# EAGLE design psu (EAGLE 6.4)

## Sheet 1 of 2
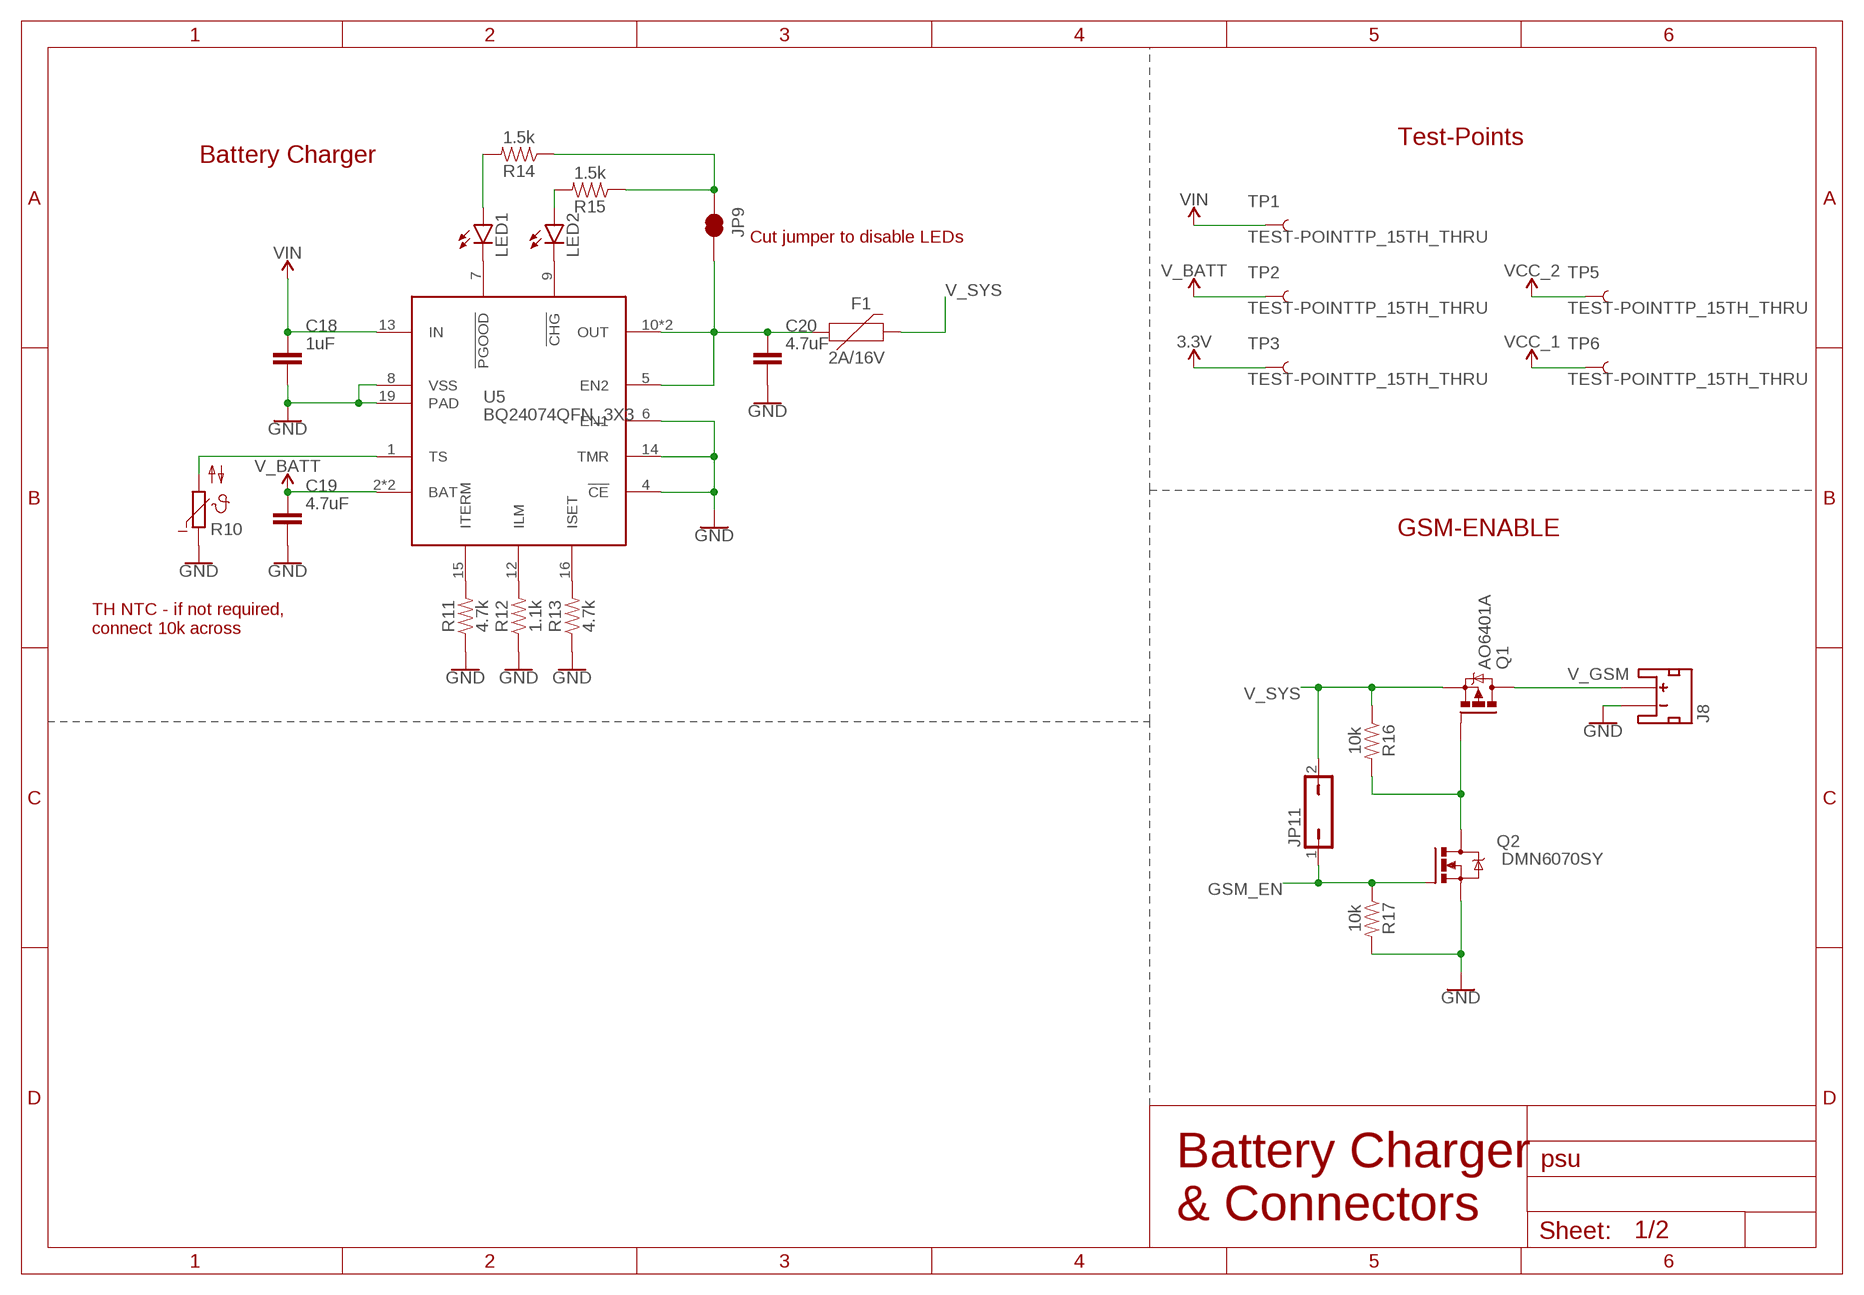
[diagram p0: schematic, sheet 1]

### Parts
C18  1uF  C_CHIP-0805(2012-METRIC)  [CAPC2012X110]
C19  4.7uF  C_CHIP-0805(2012-METRIC)  [CAPC2012X110]
C20  4.7uF  C_CHIP-0805(2012-METRIC)  [CAPC2012X110]
F1  2A/16V  PPTC_2A  [F1812]
J8  JST_2MM_MALE  [JST-2-SMD]
JP9  JUMPER-SMT_2_NC_TRACE_SILK  [SMT-JUMPER_2_NC_TRACE_SILK]
JP11  JP1Q  [JP1]
LED1  LEDSML0805  [SML0805]
LED2  LEDSML0805  [SML0805]
Q1  AO6401A  [TSOP-6]
Q2  DMN6070SY  DMN6070SY-13  [SOT-89-3]
R10  DNF  NTC640  [P640]
R11  4.7k  RESISTOR0603  [0603]
R12  1.1k  RESISTOR0603  [0603]
R13  4.7k  RESISTOR0603  [0603]
R14  1.5k  RESISTOR0603  [0603]
R15  1.5k  RESISTOR0603  [0603]
R16  10k  RESISTOR0603  [0603]
R17  10k  RESISTOR0603  [0603]
TP1  TEST-POINTTP_15TH_THRU  [TP_15TH]
TP2  TEST-POINTTP_15TH_THRU  [TP_15TH]
TP3  TEST-POINTTP_15TH_THRU  [TP_15TH]
TP5  TEST-POINTTP_15TH_THRU  [TP_15TH]
TP6  TEST-POINTTP_15TH_THRU  [TP_15TH]
U5  BQ24074QFN_3X3  [QFN_3X3]

### Nets
3.3V: TP3.P$1 ; also sheet 2
GND: C18.2 C19.2 C20.2 J8.1(-) Q2.3(S) R10.1 R11.1 R12.1 R13.1 R17.2 U5.4(!CE) U5.6(EN1) U5.8(VSS) U5.14(TMR) U5.19(PAD) ; also sheet 2
GSM_EN: JP11.1 Q2.1(G) R17.1
N$19: R10.2 U5.1(TS)
N$20: R11.2 U5.15(ITERM)
N$21: R12.2 U5.12(ILM)
N$22: R13.2 U5.16(ISET)
N$23: LED1.C U5.7(!PGOOD)
N$24: LED2.C U5.9(!CHG)
N$25: JP9.1 R14.1 R15.1
N$27: LED1.A R14.2
N$28: LED2.A R15.2
N$29: C20.1 F1.1 JP9.2 U5.5(EN2) U5.10(OUT) U5.11(OUT)
N$34: Q1.3(G) Q2.2(D) Q2.4(D) R16.2
V_BATT: C19.1 TP2.P$1 U5.2(BAT) U5.3(BAT)
V_GSM: J8.2(+) Q1.1(D) Q1.2(D) Q1.5(D) Q1.6(D)
V_SYS: F1.2 JP11.2 Q1.4(S) R16.1 ; also sheet 2
VCC_1: TP6.P$1 ; also sheet 2
VCC_2: TP5.P$1 ; also sheet 2
VIN: C18.1 TP1.P$1 U5.13(IN)
Unconnected: J8.NC1(PAD1) J8.NC2(PAD2)

### Notes on the sheet
- Test-Points
- Battery Charger
- Cut jumper to disable LEDs
- GSM-ENABLE
- TH NTC - if not required, 
  connect 10k across
- Battery Charger 
  & Connectors

## Sheet 2 of 2
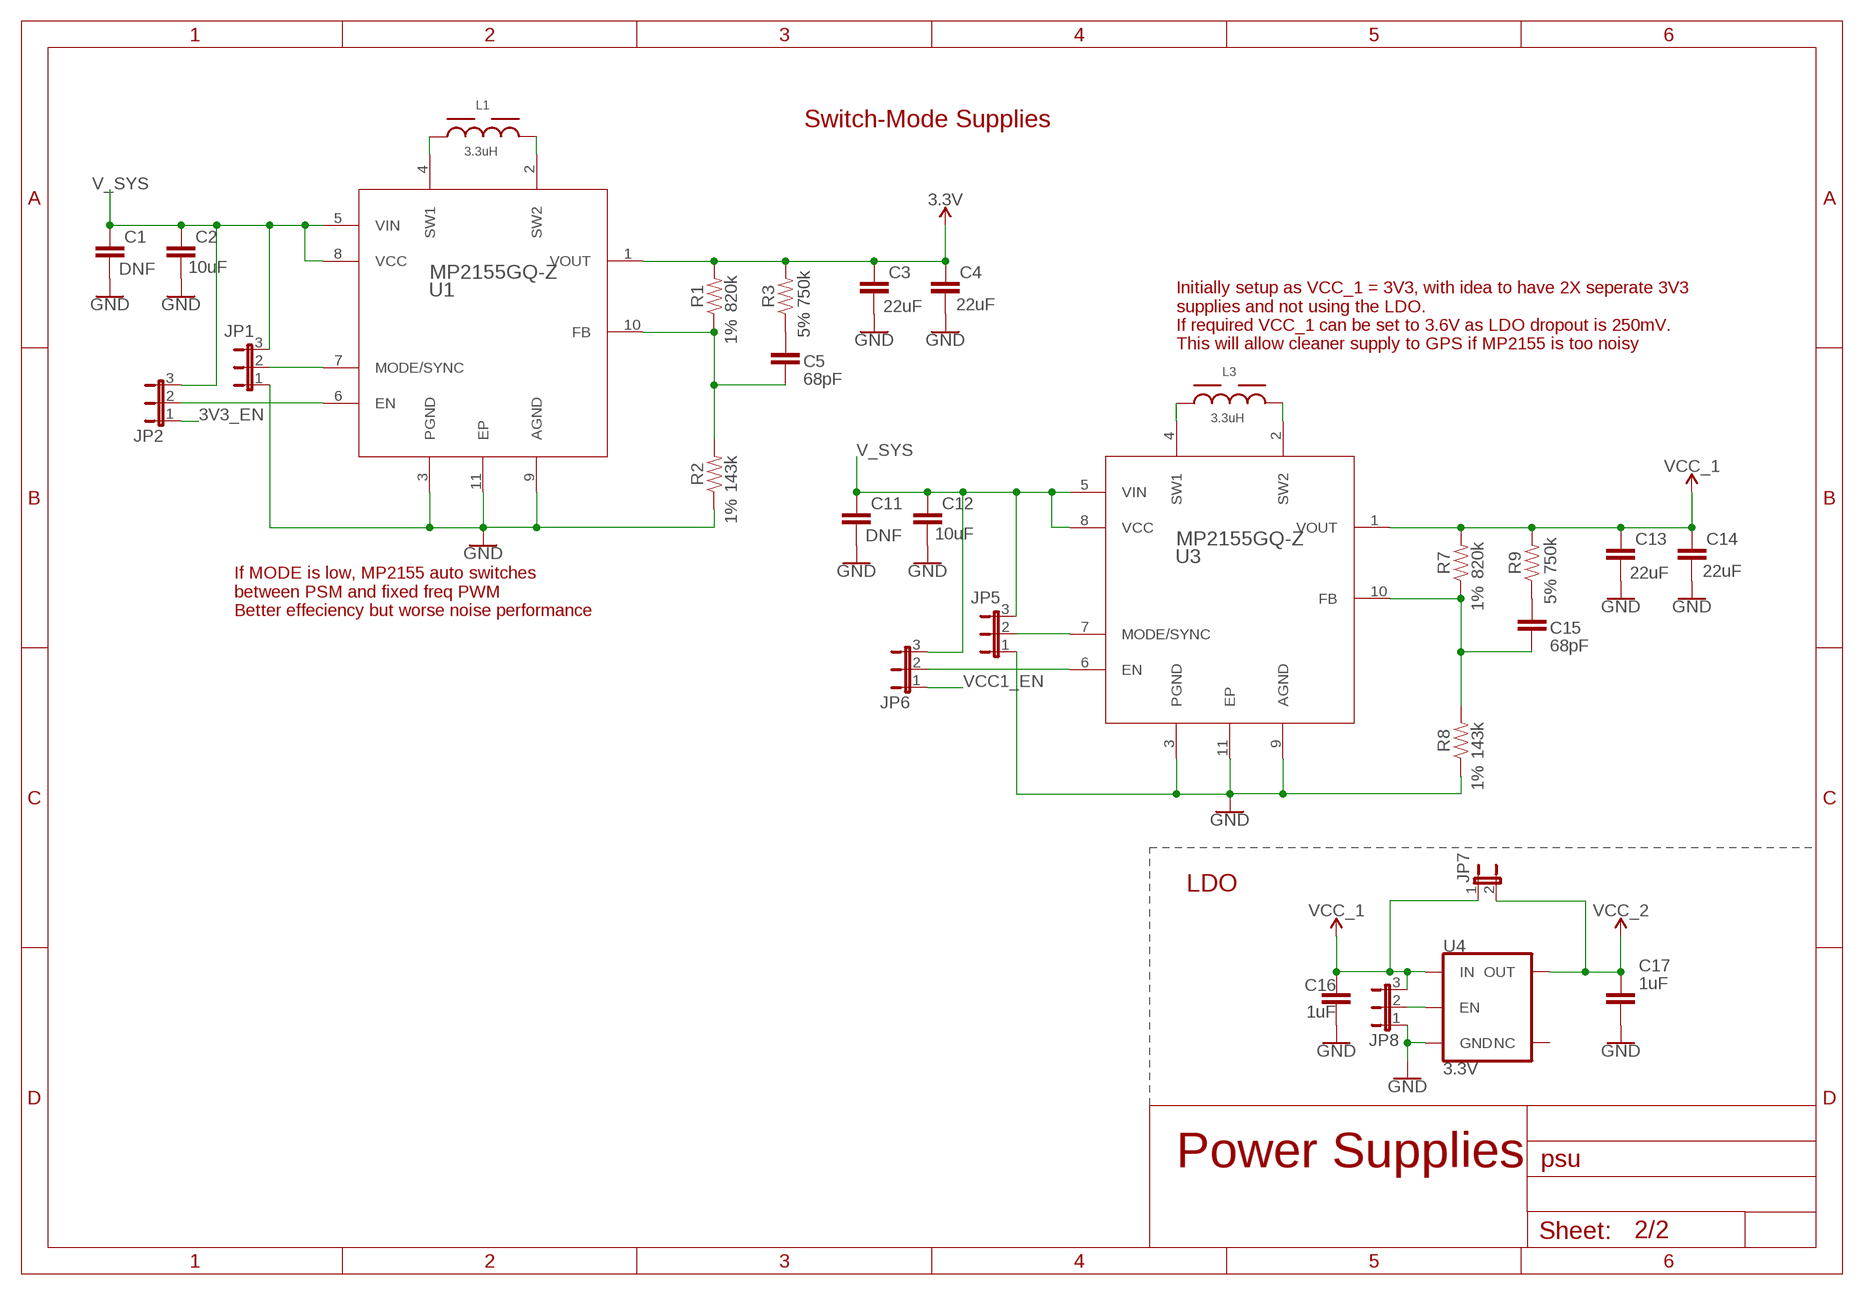
[diagram p1: schematic, sheet 2]

### Parts
C1  DNF  C_CHIP-0805(2012-METRIC)  [CAPC2012X110]
C2  10uF  C_CHIP-0805(2012-METRIC)  [CAPC2012X110]
C3  22uF  C_CHIP-0805(2012-METRIC)  [CAPC2012X110]
C4  22uF  C_CHIP-0805(2012-METRIC)  [CAPC2012X110]
C5  68pF  C_CHIP-0603(1608-METRIC)  [CAPC1608X85]
C11  DNF  C_CHIP-0805(2012-METRIC)  [CAPC2012X110]
C12  10uF  C_CHIP-0805(2012-METRIC)  [CAPC2012X110]
C13  22uF  C_CHIP-0805(2012-METRIC)  [CAPC2012X110]
C14  22uF  C_CHIP-0805(2012-METRIC)  [CAPC2012X110]
C15  68pF  C_CHIP-0603(1608-METRIC)  [CAPC1608X85]
C16  1uF  C_CHIP-0805(2012-METRIC)  [CAPC2012X110]
C17  1uF  C_CHIP-0805(2012-METRIC)  [CAPC2012X110]
JP1  JP2E  [JP2]
JP2  JP2E  [JP2]
JP5  JP2E  [JP2]
JP6  JP2E  [JP2]
JP7  JP1E  [JP1]
JP8  JP2E  [JP2]
L1  3.3uH  WE-HCI_7050_744314330  [WE-HCI_7050]
L3  3.3uH  WE-HCI_7050_744314330  [WE-HCI_7050]
R1  820k  RESISTOR0603  [0603]
R2  143k  RESISTOR0603  [0603]
R3  750k  RESISTOR0603  [0603]
R7  820k  RESISTOR0603  [0603]
R8  143k  RESISTOR0603  [0603]
R9  750k  RESISTOR0603  [0603]
U1  MP2155GQ-Z  [QFN-10_MP2155_MNP]
U3  MP2155GQ-Z  [QFN-10_MP2155_MNP]
U4  3.3V  V_REG_AP2112K-3.3V  [SOT23-5]

### Nets
3.3V: C3.1 C4.1 R1.2 R3.2 U1.1(VOUT) ; also sheet 1
3V3_EN: JP2.1
GND: C1.2 C2.2 C3.2 C4.2 C11.2 C12.2 C13.2 C14.2 C16.2 C17.2 JP1.1 JP5.1 JP8.1 R2.1 R8.1 U1.3(PGND) U1.9(AGND) U1.11(EP) U3.3(PGND) U3.9(AGND) U3.11(EP) U4.2(GND) ; also sheet 1
N$1: C5.1 R3.1
N$2: JP1.2 U1.7(MODE/SYNC)
N$3: C5.2 R1.1 R2.2 U1.10(FB)
N$4: JP2.2 U1.6(EN)
N$5: L1.1 U1.4(SW1)
N$6: L1.2 U1.2(SW2)
N$13: JP5.2 U3.7(MODE/SYNC)
N$14: JP6.2 U3.6(EN)
N$15: C15.2 R7.1 R8.2 U3.10(FB)
N$16: C15.1 R9.1
N$17: L3.1 U3.4(SW1)
N$18: L3.2 U3.2(SW2)
N$26: JP8.2 U4.3(EN)
V_SYS: C1.1 C2.1 C11.1 C12.1 JP1.3 JP2.3 JP5.3 JP6.3 U1.5(VIN) U1.8(VCC) U3.5(VIN) U3.8(VCC) ; also sheet 1
VCC1_EN: JP6.1
VCC_1: C13.1 C14.1 C16.1 JP7.1 JP8.3 R7.2 R9.2 U3.1(VOUT) U4.1(IN) ; also sheet 1
VCC_2: C17.1 JP7.2 U4.5(OUT) ; also sheet 1
Unconnected: U4.4(NC)

### Notes on the sheet
- Switch-Mode Supplies
- Initially setup as VCC_1 = 3V3, with idea to have 2X seperate 3V3 
  supplies and not using the LDO.
  If required VCC_1 can be set to 3.6V as LDO dropout is 250mV.
  This will allow cleaner supply to GPS if MP2155 is too noisy
- If MODE is low, MP2155 auto switches 
  between PSM and fixed freq PWM
  Better effeciency but worse noise performance
- LDO
- Power Supplies

## Library data of the parts
C1 C11 C16-C20 = Capacitor:C: Capacitor - Generic; CATEGORY: Capacitor
C2 C12 = Capacitor:C: Capacitor - Generic; CATEGORY: Capacitor; TYPE: X7R; VOLTAGE_RATING: 6.3V
C3 C4 C13 C14 = Capacitor:C: Capacitor - Generic; CATEGORY: Capacitor; TYPE: X5R; VOLTAGE_RATING: 10V
C5 C15 = Capacitor:C: Capacitor - Generic; CATEGORY: Capacitor; TYPE: X7R; VOLTAGE_RATING: 50V
F1 = GlacTracker:PPTC_2A
J8 = SparkFun-Connectors:JST_2MM_MALE: JST 2MM MALE RA CONNECTOR Two pin, compact surface mount connector. Commonly used as a battery input connection point. We really like the solid locking feeling and high current rating on these small connectors. We use these all the time as battery connectors. Mates to single-cell LiPo batteries. Here is the connector we sell at SparkFun: JST Right Angle Connector - White <https://www.sparkfun.com/products/8612> (PRT-08612) Datasheet <http://www.sparkfun.com/datasheets/Prototyping/Connectors/JST-Horizontal.pdf> It was used on these SparkFun products: SparkFun MOSFET Power Controller <https://www.sparkfun.com/products/11214> (PRT-11214) SparkFun Battery Babysitter - LiPo Battery Manager <https://www.sparkfun.com/products/13777> (PRT-13777) And many, many others that required a lipo battery connection.; PROD_ID: CONN-11443; SF_ID: PRT-08612
JP1 JP2 JP5 JP6 JP8 = jumper:JP2E: JUMPER
JP7 = jumper:JP1E: JUMPER
JP9 = SparkFun-Jumpers:JUMPER-SMT_2_NC_TRACE: Normally closed trace jumper This jumper has a trace between two pads so it's normally closed (NC). Use a razor knife to open the connection. For best results follow the IPC guidelines for cutting traces: Cutout at least 0.063 mm (0.005 in). Remove all loose material to clean up the cut area. Seal the cut with an approved epoxy. Reapply solder to reclose the connection.
JP11 = jumper:JP1Q: JUMPER
L1 L3 = Eagle_WE-HCI (rev19a):WE-HCI_7050: WE-HCI SMD Flat Wire High Current Inductor Shielded Characteristics AECQ 200 qualified Magnetically shielded Flat wire coil for low losses at high frequency Low stray field Operating temperature: –40 °C to +125°C / +150 °C / +155°C Recommended solder profile: Reflow Applications Graphic cards Laptops Industrial computers Motherboards High current switching regulators DC/DC converter Polyphase-switching regulators Filter <https://katalog.we-online.de/media/images/v2/o14796v209%20Family_WE-HCI.jpg> Details see: https://katalog.we-online.de/en/pbs/WE-HCI#vs_ct:13 Updated by Yingchun, Shan 2019-08-06 2019 (C) Wurth Elektronik; DATASHEET-URL: https://katalog.we-online.com/pbs/datasheet/744314330.pdf; FRES: 65MHz; IR: 9A; ISAT: 8A; LR: 2.2uH; MATERIAL: Superflux; PART-NUMBER: 744314330; RDC: 9mOhm
LED1 LED2 = led:LED: LED OSRAM: - CHIPLED LG R971, LG N971, LY N971, LG Q971, LY Q971, LO R971, LY R971 LH N974, LH R974 LS Q976, LO Q976, LY Q976 LO Q996 - Hyper CHIPLED LW Q18S LB Q993, LB Q99A, LB R99A - SideLED LS A670, LO A670, LY A670, LG A670, LP A670 LB A673, LV A673, LT A673, LW A673 LH A674 LY A675 LS A676, LA A676, LO A676, LY A676, LW A676 LS A679, LY A679, LG A679 - Hyper Micro SIDELED® LS Y876, LA Y876, LO Y876, LY Y876 LT Y87S - SmartLED LW L88C, LW L88S LB L89C, LB L89S, LG L890 LS L89K, LO L89K, LY L89K LS L896, LA L896, LO L896, LY L896 - TOPLED LS T670, LO T670, LY T670, LG T670, LP T670 LSG T670, LSP T670, LSY T670, LOP T670, LYG T670 LG T671, LOG T671, LSG T671 LB T673, LV T673, LT T673, LW T673 LH T674 LS T676, LA T676, LO T676, LY T676, LB T676, LH T676, LSB T676, LW T676 LB T67C, LV T67C, LT T67C, LS T67K, LO T67K, LY T67K, LW E67C LS E67B, LA E67B, LO E67B, LY E67B, LB E67C, LV E67C, LT E67C LW T67C LS T679, LY T679, LG T679 LS T770, LO T770, LY T770, LG T770, LP T770 LB T773, LV T773, LT T773, LW T773 LH T774 LS E675, LA E675, LY E675, LS T675 LS T776, LA T776, LO T776, LY T776, LB T776 LHGB T686 LT T68C, LB T68C - Hyper Mini TOPLED® LB M676 - Mini TOPLED Santana® LG M470 LS M47K, LO M47K, LY M47K Source: http://www.osram.convergy.de LUXEON: - LUMILED® LXK2-PW12-R00, LXK2-PW12-S00, LXK2-PW14-U00, LXK2-PW14-V00 LXK2-PM12-R00, LXK2-PM12-S00, LXK2-PM14-U00 LXK2-PE12-Q00, LXK2-PE12-R00, LXK2-PE12-S00, LXK2-PE14-T00, LXK2-PE14-U00 LXK2-PB12-K00, LXK2-PB12-L00, LXK2-PB12-M00, LXK2-PB14-N00, LXK2-PB14-P00, LXK2-PB14-Q00 LXK2-PR12-L00, LXK2-PR12-M00, LXK2-PR14-Q00, LXK2-PR14-R00 LXK2-PD12-Q00, LXK2-PD12-R00, LXK2-PD12-S00 LXK2-PH12-R00, LXK2-PH12-S00 LXK2-PL12-P00, LXK2-PL12-Q00, LXK2-PL12-R00 Source: www.luxeon.com KINGBRIGHT: KA-3528ASYC Source: www.kingbright.com
Q1 = GlacTracker:AO6401A
Q2 = GlacTracker:DMN6070SY-13
R1 R2 R7 R8 = SparkFun-Resistors:RESISTOR: Generic Resistor Package; TOLERANCE: 1%
R3 R9 = SparkFun-Resistors:RESISTOR: Generic Resistor Package; TOLERANCE: 5%
R10 = ptc-ntc:NTC640: PHILIPS NTC; OC_FARNELL: unknown; OC_NEWARK: unknown
R11-R17 = SparkFun-Resistors:RESISTOR: Generic Resistor Package
TP1-TP3 TP5 TP6 = SparkFun-Connectors:TEST-POINT: SparkFun Test Points Bare copper test points for troubleshooting or In-Circuit-Testing. These are used by our Production team for verifying production board runs using pogo-pins on test beds. SparkFun Products: SparkFun LSM9DS1 Breakout <https://www.sparkfun.com/products/13284> SparkFun PSOC <https://www.sparkfun.com/products/13714> SparkFun Load Cell Amplifier <https://www.sparkfun.com/products/13879>
U1 U3 = GlacTracker:MP2155GQ-Z; COPYRIGHT: Copyright (C) 2022 Ultra Librarian. All rights reserved.; MANUFACTURER_PART_NUMBER: MP2155GQ-Z; MFR_NAME: Monolithic Power Systems
U4 = SparkFun-IC-Power:V_REG_AP2112: AP2112 - 600mA CMOS LDO Regulator w/ Enable The AP2112 is CMOS process low dropout linear regulator with enable function, the regulator delivers a guaranteed 600mA (min.) continuous load current. Features Output Voltage Accuracy: ±1.5% Output Current: 600mA (Min.) Foldback Short Current Protection: 50mA Enable Function to Turn ON/OFF VOUT Low Dropout Voltage (3.3V): 250mV (Typ.) @IOUT=600mA Excellent Load Regulation: 0.2%/A (Typ.) Excellent Line Regulation: 0.02%/V (Typ.) Low Quiescent Current: 55μA (Typ.) Low Standby Current: 0.01μA (Typ.) Low Output Noise: 50μVRMS PSRR: 100Hz -65dB, 1kHz -65dB OTSD Protection Stable with 1.0μF Flexible Cap: Ceramic, Tantalum and Aluminum Electrolytic Operation Temperature Range: -40°C to 85°C ESD: MM 400V, HBM 4000V; PROD_ID: VREG-12457
U5 = GlacTracker:BQ24074

## Board
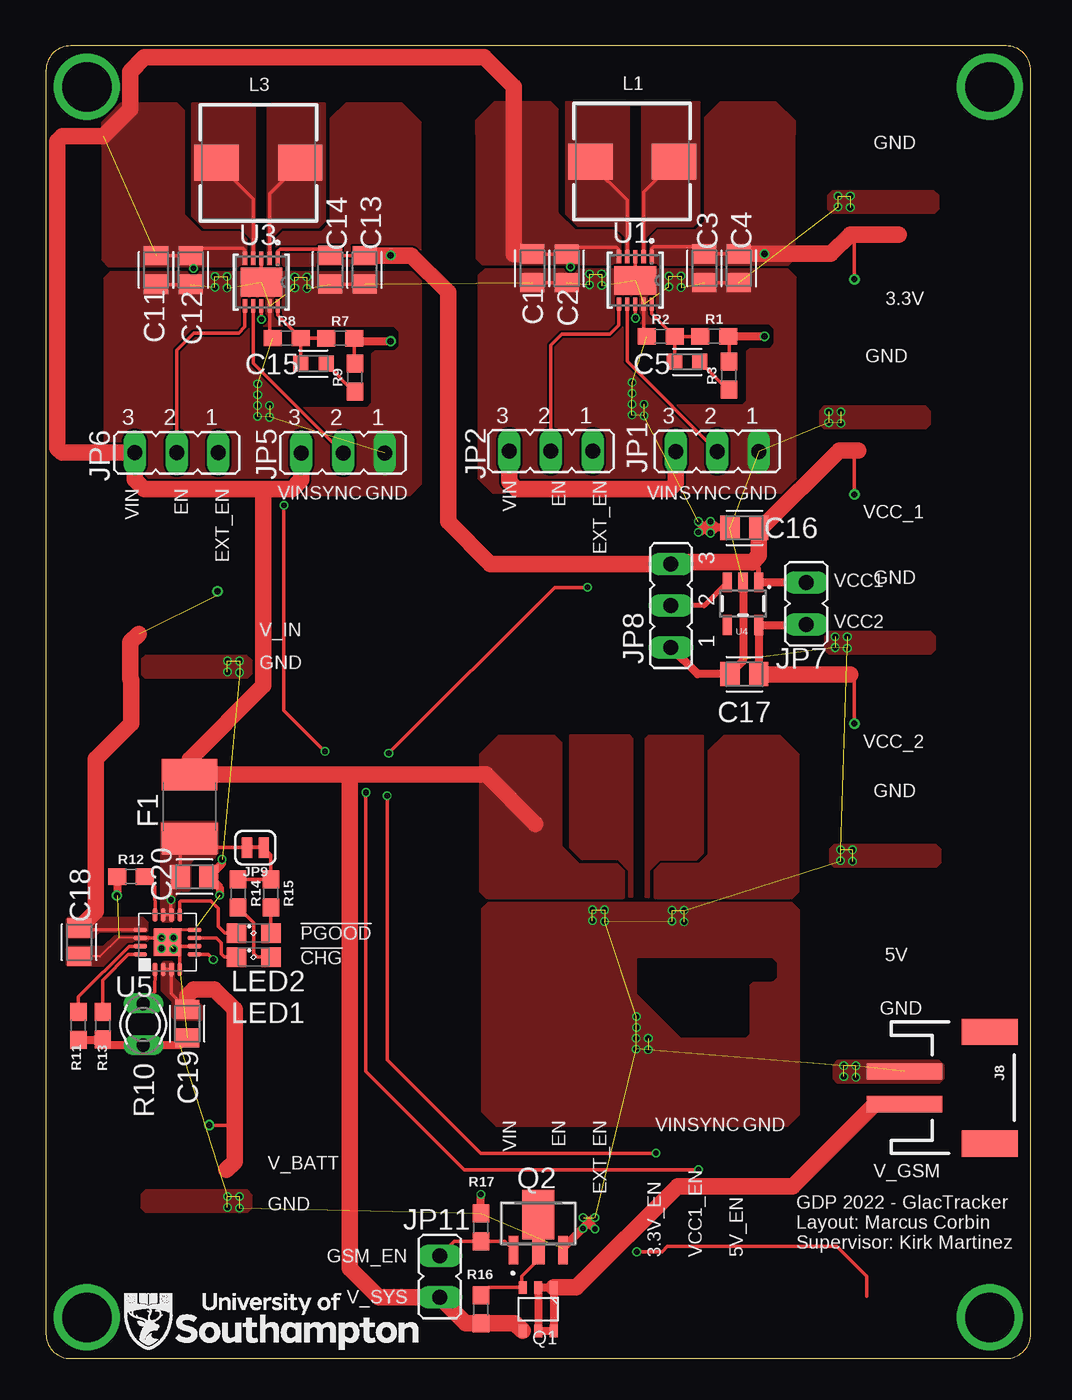
[diagram p2: board, top side]
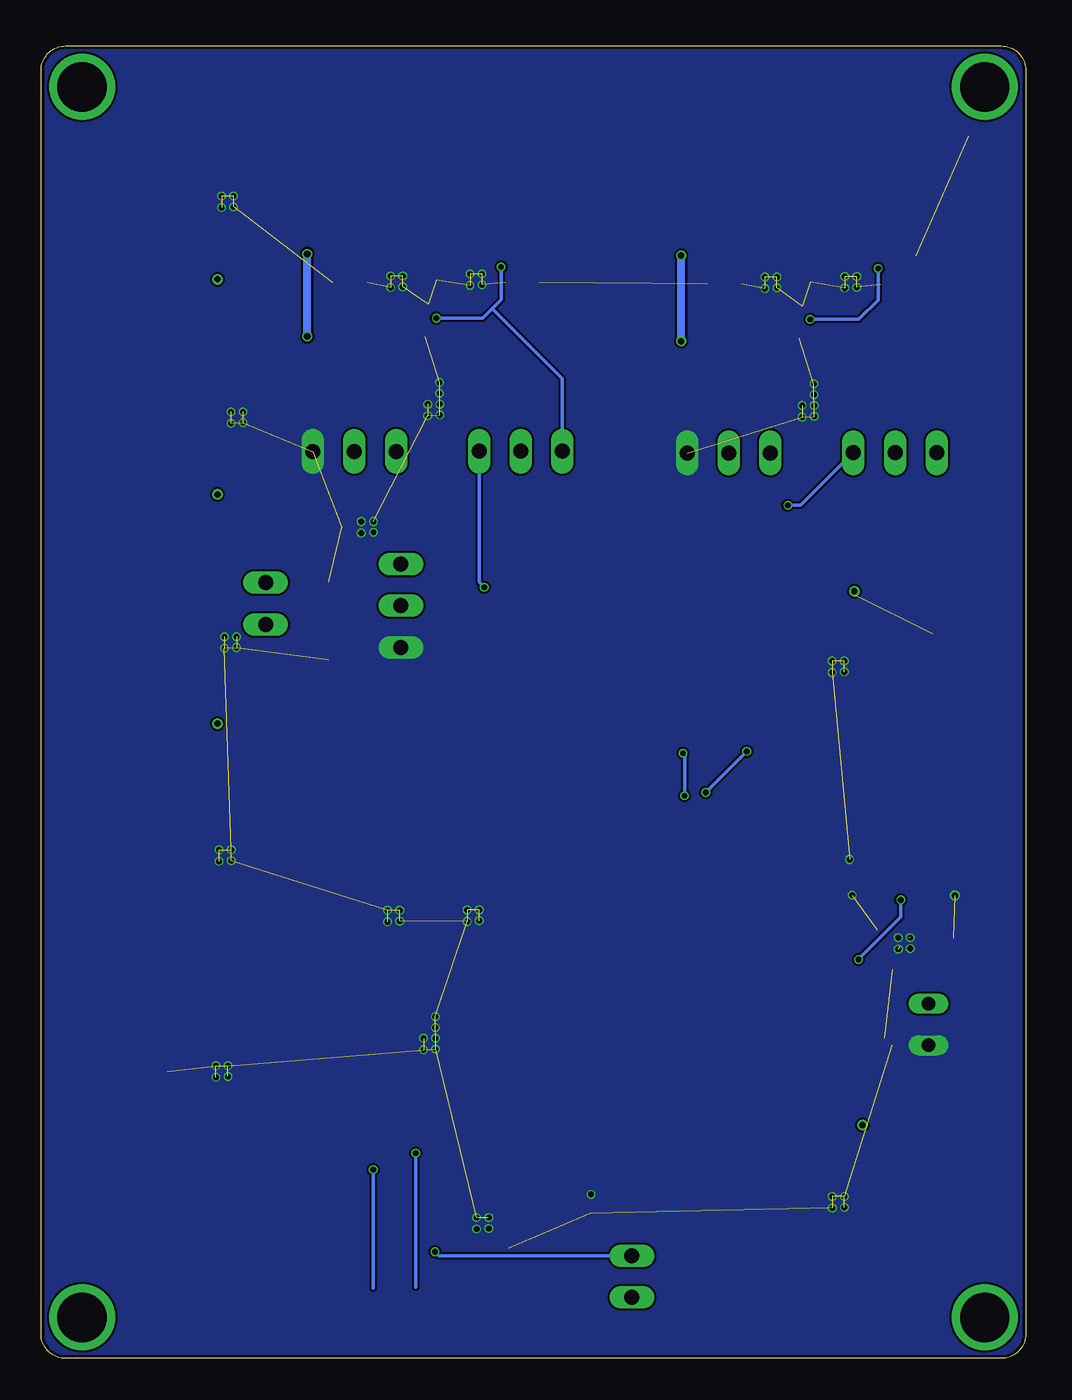
[diagram p3: board, bottom side, seen from below]

Size 60 x 80 mm. Coordinates in mm from the lower left corner, seen from the top.
Outline: 1.5,0 58.5,0 arc90 60,1.5 60,78.5 arc90 58.5,80 1.5,80 arc90 0,78.5 0,1.5 arc90 1.5,0
Copper layers (1*16): Top 0.035559375mm / dielectric 1.6mm / Bottom 0.035559375mm
Design rules "jlcpcb2layer": minimum track width 5mil, minimum drill 12mil, track to track 5mil, track to pad 5mil, pad to pad 5mil, via to via 5mil, smd to smd 5mil, copper to edge 8mil, drill to drill 6mil, minimum pad ring 5mil, minimum via ring 3mil, stop-mask expansion 2.5mil, vias tented up to drill 0mil, thermal gap 10mil

### Footprints (pad centres in the part's own frame; a part is rotated, then mirrored left to right if it is on the bottom)
CAPC2012X110 = smd 1.165 x 1.465: 1 -0.875,0; 2 0.875,0
CAPC1608X85 = smd 0.921 x 0.97: 1 -0.775,0; 2 0.775,0
F1812 = smd 1.9 x 3.4: 1 -1.95,0; 2 1.95,0
JST-2-SMD = smd 1 x 4.6: 1 -1,-3.7; 2 1,-3.7 | smd 1.6 x 3.4: NC1 -3.4,1.5; NC2 3.4,1.5
JP2 = drill 0.914 long: 1 -2.54,0; 2 0,0; 3 2.54,0
JP1 = drill 0.914 long: 1 0,-1.27; 2 0,1.27
SMT-JUMPER_2_NC_TRACE_SILK = smd 0.635 x 1.27: 1 -0.508,0; 2 0.508,0
WE-HCI_7050 = smd 2.7 x 2.2: 1 -2.55,0; 2 2.55,0
SML0805 = smd 1.2 x 1.2: A 1.05,0; C -1.05,0
TSOP-6 = smd 0.5 x 0.75: 1 -0.95,-1.325; 2 0,-1.325; 3 0.95,-1.325; 4 0.95,1.325; 5 0,1.325; 6 -0.95,1.325
SOT-89-3 = smd 0.58 x 1.73: 1 -1.5,-1.385; 3 1.5,-1.385 | smd 0.76 x 1.5: 2 0,-1.5 | smd 1.933 x 3.03: 4 0,0.765
0603 = smd 1.1 x 1: 1 -0.85,0; 2 0.85,0
P640 = drill 0.813 long: 1 -1.27,0; 2 1.27,0
TP_15TH = drill 0.381 pad 0.61: P$1 0,0
QFN-10_MP2155_MNP = smd 0.813 x 0.254: 1 -1.448,1; 2 -1.448,0.5; 3 -1.448,0; 4 -1.448,-0.5; 5 -1.448,-1; 6 1.448,-1; 7 1.448,-0.5; 8 1.448,0; 9 1.448,0.5; 10 1.448,1 | smd 1.753 x 2.54: 11 0,0
SOT23-5 = smd 0.55 x 1.2: 1 -0.95,-1.3; 2 0,-1.3; 3 0.95,-1.3; 4 0.95,1.3; 5 -0.95,1.3
QFN_3X3 = smd 0.85 x 0.3: 1 -1.655,0.75; 2 -1.655,0.25; 3 -1.655,-0.25; 4 -1.655,-0.75; 9 1.655,-0.75; 10 1.655,-0.25; 11 1.655,0.25; 12 1.655,0.75 | smd 0.3 x 0.85: 5 -0.75,-1.655; 6 -0.25,-1.655; 7 0.25,-1.655; 8 0.75,-1.655; 13 0.75,1.655; 14 0.25,1.655; 15 -0.25,1.655; 16 -0.75,1.655 | smd 1.68 x 1.68: 19 0,0

### Placement (x,y rotation side)
C1  29.64,66.44 270 top
C2  31.73,66.44 270 top
C3  40.12,66.45 270 top
C4  42.22,66.45 270 top
C5  39.07,60.75 180 top
C11  6.71,66.34 270 top
C12  8.83,66.34 270 top
C13  19.41,66.35 270 top
C14  17.32,66.35 270 top
C15  16.29,60.64 180 top
C16  42.55,50.63 180 top
C17  42.55,41.71 180 top
C18  2.02,25.37 270 top
C19  8.61,20.41 270 top
C20  9.05,29.36 0 top
F1  8.75,33.63 90 top
J8  56,16.5 270 top
JP1  40.9,55.29 180 top
JP2  30.77,55.3 180 top
JP5  18.1,55.2 180 top
JP6  7.97,55.21 180 top
JP7  46.32,46.01 180 top
JP8  38.08,45.88 90 top
JP9  12.76,31.13 180 top
JP11  24,5 180 top
L1  35.72,72.95 0 top
L3  12.95,72.88 0 top
LED1  12.66,24.46 0 top
LED2  12.66,25.92 0 top
Q1  30,3 180 top
Q2  30,8 0 top
R1  40.72,62.3 0 top
R2  37.45,62.29 0 top
R3  41.62,59.91 90 top
R7  17.93,62.18 0 top
R8  14.67,62.19 0 top
R9  18.82,59.79 90 top
R10  5.93,20.36 90 top
R11  1.98,20.28 90 top
R12  5.18,29.37 0 top
R13  3.46,20.29 90 top
R14  11.71,28.33 270 top
R15  13.7,28.34 270 top
R16  26.5,3 90 top
R17  26.5,8 90 top
TP1  10.45,46.76 0 top
TP2  9.95,14.22 0 top
TP3  49.25,65.78 0 top
TP5  49.25,38.7 0 top
TP6  49.25,52.66 0 top
U1  35.91,65.71 270 top
U3  13.13,65.6 270 top
U4  42.47,46.01 180 top
U5  7.4,25.38 90 top

### Tracks (layer width: path | path; a pad name or v marks a point on that pad's centre or on a via)
3.3V  (via drill 0.4)
  Top 0.2: U1.1 36.91,67.65 37.04,67.77 39.67,67.77 C3.1 C4.1 | R3.2 41.62,62.24 R1.2 | TP3.P$1 49.25,68.25 49.5,68.5
  Top 0.5: R1.2 v43.77,62.3 v43.78,62.29 | v43.78,67.33 C4.1
  Top 1: C4.1 47.82,67.32 49,68.5 49.5,68.5 51.97,68.5
  Bottom 0.5: v43.78,62.29 v43.78,67.33
  pour Top (no thermals): 45.63,73.72 45.63,67.06 45.21,66.64 36.89,66.64 36.83,66.7 36.83,68.31 37.28,68.75 39.6,68.75 40.14,69.29 40.14,75.62 41.1,76.58 44.48,76.58 45.64,75.42
3V3_EN  (via drill 0.35)
  Top 0.2: v33,47 30.99,47 v20.89,36.89 | v20.79,34.3 20.79,18.21 26.48,12.52 v37.17,12.52
  Bottom 0.2: JP2.1 33.31,47.31 v33,47 | v20.89,36.89 20.79,36.8 v20.79,34.3 | v37.17,12.52 37.17,4.33
5V
  pour Top (no thermals): 45.85,35.13 45.85,28.46 45.44,28.04 37.12,28.04 37.05,28.1 37.05,29.71 37.5,30.16 39.82,30.16 40.36,30.7 40.36,37.02 41.32,37.98 44.71,37.98 45.86,36.82
GND  (via drill 0.35, 0.4)  (91 unrouted)
  Top 0.127: U5.14 4.42,25.63 3.29,24.5 C18.2
  Top 0.2: U5.14 7.14,25.63 | U5.6 7.65,25.12 U5.19 | U5.8 7.65,26.14 7.14,25.63 | U1.3 U1.11 | U1.9 36.41,62.48 R2.1 | U3.3 U3.11 | C11.2 C12.2 | C14.2 C13.2 | C1.2 C2.2 | C4.2 C3.2 | U3.9 13.63,62.38 R8.1 | U5.19 7.5,25.38 | 7.5,25.38 v7.78,25.65 | U5.19 7.14,25.63 | U5.19 7.4,25.35 v7.04,24.99 | U5.4 8.15,24.73 7.5,25.38
  Top 0.5: JP8.1 39.71,41.71 C17.2 42.47,42.5 42.47,42.6 U4.2 | R12.1 4.33,28.23 v4.32,28.21 | R11.1 3,19.43 | 3,19.43 R13.1 | C19.2 8.17,19.09 R10.1 3.34,19.09 3,19.43 | v39.75,51.01 40.45,50.31 v40.49,50.31 40.81,50.63 C16.2 40.87,50.63 v40.49,51.01 39.83,50.35 v39.75,50.35 | v10.58,28.23 10.58,28.71 C20.2 10.73,30.17 v10.73,30.42 | R17.2 v26.5,10 | Q2.3 31.5,6.71 v32.72,7.93 33.38,8.59 v33.46,8.59 | v33.46,7.88 32.76,8.59 v32.72,8.59
  other vias: 11.79,9.17 11.06,9.87 11.06,9.21 11.79,9.87 49.15,30.3 48.41,31 48.41,30.34 49.15,31 48.82,43.29 48.09,43.99 48.09,43.33 48.82,43.99 48.43,57 47.7,57.7 47.7,57.04 48.43,57.7 49,70.15 48.27,70.85 48.27,70.19 49,70.85 38.7,65.27 37.96,65.97 37.96,65.31 38.7,65.97 33.86,65.4 33.13,66.1 33.13,65.44 33.86,66.1 15.9,65.21 15.16,65.91 15.16,65.25 15.9,65.91 11.04,65.24 10.3,65.94 10.3,65.28 11.04,65.94 11.8,41.81 11.06,42.51 11.06,41.85 11.8,42.51 13.63,57.38 12.89,58.08 12.89,57.42 13.63,58.08 12.91,59.4 12.91,58.74 36.7,18.81 35.96,19.52 35.96,18.85 36.7,19.52 35.98,20.84 35.98,20.18 34.04,26.64 33.3,27.34 33.3,26.68 34.04,27.34 38.88,26.61 38.15,27.31 38.15,26.65 38.88,27.31 36.44,57.46 35.7,58.16 35.7,57.5 36.44,58.16 35.72,59.48 35.72,58.82 7.78,24.95 7.04,25.65 49.35,17.14 48.61,17.84 48.61,17.18 49.35,17.84
  pour Top (no thermals): 1.63,25.1 3.52,25.1 4.18,25.76 6.27,25.76 6.27,25.54 6.11,25.38 5,25.38 3.53,23.91 1.33,23.91 1.23,24.01 1.23,24.97 1.37,25.11 1.58,25.11 1.6,25.09
  pour Top (no thermals): 3.95,66.25 3.54,65.84 3.54,53.5 4.45,52.6 22.16,52.6 22.87,53.31 22.87,65.77 22.39,66.25
  cutout Top (no thermals): 13,62.83 13,60.71 15.65,58.06 19.55,58.06 19.77,58.28 19.77,61.27 20,61.5 21.14,61.5 21.15,61.51 21.22,61.51 21.44,61.73 21.44,62.56 21.16,62.83
  pour Top (no thermals): 26.97,27.81 26.57,27.4 26.57,15.05 27.47,14.15 45.18,14.15 45.89,14.87 45.89,27.32 45.41,27.81
  cutout Top (no thermals): 36.06,24.36 36.06,22.24 38.71,19.59 42.6,19.59 42.82,19.81 42.82,22.79 43.06,23.03 44.2,23.03 44.21,23.04 44.27,23.04 44.49,23.25 44.49,24.08 44.22,24.36
  pour Top (no thermals): 26.76,66.39 26.35,65.98 26.35,53.64 27.25,52.73 44.96,52.73 45.68,53.45 45.68,65.91 45.19,66.39
  cutout Top (no thermals): 35.84,62.98 35.84,60.86 38.49,58.2 42.39,58.2 42.61,58.42 42.61,61.41 42.84,61.65 43.99,61.65 44,61.65 44.06,61.65 44.28,61.87 44.28,62.7 44.01,62.98
  pour Bottom (no thermals): 2,80 60,80 60,0 0,0 0,80
  pour Top (no thermals): 6.1,10.27 12.23,10.27 12.55,9.96 12.55,9.17 12.28,8.9 6.07,8.9 5.8,9.17 5.8,9.97
  pour Top (no thermals): 48.06,31.33 54.19,31.33 54.51,31.02 54.51,30.23 54.24,29.96 48.03,29.96 47.76,30.23 47.76,31.03
  pour Top (no thermals): 47.75,44.32 53.88,44.32 54.19,44 54.19,43.21 53.92,42.95 47.72,42.95 47.45,43.22 47.45,44.02
  pour Top (no thermals): 47.44,58.04 53.57,58.04 53.88,57.72 53.88,56.93 53.61,56.67 47.41,56.67 47.14,56.94 47.14,57.74
  pour Top (no thermals): 47.94,71.18 54.07,71.18 54.39,70.87 54.39,70.08 54.12,69.81 47.91,69.81 47.64,70.08 47.64,70.88
  pour Top (no thermals): 6.09,42.86 12.22,42.86 12.53,42.54 12.53,41.76 12.26,41.49 6.06,41.49 5.79,41.76 5.79,42.56
  pour Top (no thermals): 48.26,18.18 54.39,18.18 54.7,17.86 54.7,17.07 54.43,16.8 48.23,16.8 47.96,17.07 47.96,17.88
GSM_EN  (via drill 0.35)
  Top 0.2: Q2.1 27.96,7.15 R17.1 24.88,7.15 JP11.1 | v36,6.5 37.54,6.5 37.87,6.83 48.17,6.83 50,5 50,3.78
  Bottom 0.2: JP11.1 35.77,6.27 v36,6.5
N$1
  Top 0.2: C5.1 41.53,59.06 R3.1
N$2
  Top 0.2: JP1.2 35.41,60.78 U1.7
N$3
  Top 0.2: U1.10 36.91,63.68 R2.2 | R2.2 39.86,62.29 R1.1 | R2.2 C5.2
N$4
  Top 0.2: JP2.2 30.77,61.77 31.44,62.44 34.37,62.44 34.91,62.98 U1.6
N$5
  Top 0.2: U1.4 35.41,70.59 33.17,72.83 L1.1
  pour Top (no thermals): 31.67,76.61 31.67,69.77 32.43,69.01 34.64,69.01 35.29,68.37 35.29,66.76 35.31,66.74 35.53,66.74 35.53,76.38 35.31,76.61
N$6
  Top 0.2: U1.2 36.41,71.09 L1.2
  pour Top (no thermals): 39.84,76.59 39.84,69.42 39.41,68.99 37.19,68.99 36.55,68.35 36.55,66.74 36.53,66.72 36.31,66.72 36.31,76.36 36.53,76.59
N$11
  pour Top (no thermals): 31.9,38 31.9,31.16 32.66,30.4 34.87,30.4 35.52,29.76 35.52,28.14 35.54,28.12 35.76,28.12 35.76,37.77 35.54,38
N$12
  pour Top (no thermals): 40.05,37.98 40.05,30.81 39.62,30.39 37.4,30.39 36.76,29.74 36.76,28.13 36.74,28.11 36.51,28.11 36.51,37.76 36.74,37.98
N$13
  Top 0.2: U3.7 12.63,60.67 JP5.2
N$14
  Top 0.2: JP6.2 7.97,61.47 9,62.5 11.75,62.5 12.13,62.88 U3.6
N$15
  Top 0.2: U3.10 14.13,63.58 R8.2 | R8.2 15.53,62.18 R7.1 | R8.2 C15.2
N$16
  Top 0.2: C15.1 18.76,58.94 R9.1
N$17
  Top 0.2: U3.4 12.63,70.65 L3.1
  pour Top (no thermals): 8.9,76.5 8.9,69.66 9.66,68.91 11.87,68.91 12.52,68.26 12.52,66.65 12.54,66.63 12.76,66.63 12.76,76.28 12.54,76.5
N$18
  Top 0.2: U3.2 13.63,71 L3.2
  pour Top (no thermals): 17.03,76.52 17.03,69.35 16.6,68.93 14.38,68.93 13.74,68.28 13.74,66.67 13.72,66.65 13.5,66.65 13.5,76.3 13.72,76.52
N$19
  Top 0.2: U5.1 6.64,22.33 R10.2
N$20
  Top 0.2: R11.2 1.98,22.03 5.07,25.12 U5.15
N$21
  Top 0.2: U5.12 6.64,28.77 R12.2
N$22
  Top 0.2: U5.16 5.03,24.61 3.46,23.05 R13.2
N$23
  Top 0.2: U5.7 10.37,25.63 10.68,25.32 10.68,24.65 10.86,24.46 LED1.C
N$24
  Top 0.2: U5.9 8.16,27.82 8.23,27.88 10.05,27.88 10.49,27.44 10.49,26.32 10.89,25.93 LED2.C
N$25
  Top 0.2: JP9.1 13.7,30.7 R15.1 R14.1
N$26
  Top 0.3: U4.3 40.1,45.88 JP8.2
N$27
  Top 0.2: R14.2 12.65,26.54 12.65,24.69 12.88,24.46 LED1.A
N$28
  Top 0.2: R15.2 13.7,25.93 LED2.A
N$29  (via drill 0.35)
  Top 0.2: U5.11 U5.10 7.61,27.07 v7.62,27.95 7.62,28.8 C20.1 8.18,31.11 F1.1 9.3,31.13 JP9.2 | U5.5 9.9,24.61 v10.2,24.32
  Bottom 0.2: v10.2,24.32 7.62,26.9 v7.62,27.95
  pour Top (no thermals): 7.12,26.6 7.68,26.6 7.84,26.75 7.84,28.13 8.19,28.48 8.71,28.48 8.83,28.61 8.83,30.22 9.1,30.5 10.38,30.5 10.5,30.61 10.5,32.61 10.37,32.74 7.11,32.74 7,32.63 7,26.72
N$30  (via drill 3)
  other vias: 2.5,77.5
N$31  (via drill 3)
  other vias: 57.5,77.5
N$32  (via drill 3)
  other vias: 57.5,2.5
N$33  (via drill 3)
  other vias: 2.5,2.5
N$34
  Top 0.2: Q2.4 Q2.2 30,6 29,5 29,4.38 Q1.3 26.98,4.33 R16.2
N$36
  pour Top (no thermals): 22.83,73.65 22.83,66.99 22.41,66.57 14.09,66.57 14.03,66.63 14.03,68.24 14.47,68.68 16.8,68.68 17.34,69.23 17.34,75.55 18.29,76.51 21.68,76.51 22.84,75.35
V_BATT
  Top 0.2: C19.1 7.65,22.25 U5.3 U5.2 | TP2.P$1 11.28,14.22 11.5,14
  Top 1: 11,11.5 11.5,12 11.5,14 11.5,21.27 10.27,22.5 9,22.5 8.61,22.11 C19.1
  pour Top (no thermals): 7.17,24.19 7.68,24.19 7.81,24.05 7.81,23.16 9.04,21.93 9.48,21.49 9.48,20.6 7.91,20.6 7.72,20.8 7.69,20.83 7.69,21.76 7.02,22.43 7.02,23.92 7.02,23.98 7,24
V_GSM
  Top 0.5: Q1.2 Q1.1 Q1.6 Q1.5 Q1.2
  Top 1: Q1.1 32.33,4.33 38.5,10.5 45.5,10.5 50.5,15.5 J8.2
V_SYS  (via drill 0.35)  (1 unrouted)
  Top 0.2: U1.5 34.91,67.59 34.76,67.74 32.15,67.74 C2.1 | U3.5 12.13,67.54 12,67.67 9.29,67.67 C12.1 | C11.1 C12.1 | C1.1 C2.1 | U1.8 v35.92,63.4 | v31.97,66.54 31.73,66.78 C2.1 | U3.8 13.13,63.34 v13.14,63.33 | v9,66.43 8.83,66.6 C12.1
  Top 1: JP1.3 38.36,53.36 38,53 28.69,53 28.23,53.46 JP2.3 | JP5.3 15.56,53.56 15,53 13.26,53 | 13.26,53 6,53 5.43,53.57 JP6.3 1,55.21 0.7,55.5 0.7,74.2 1,74.5 3.5,74.5 5.13,76.14 5.13,78.43 6,79.3 26.7,79.3 28.5,77.5 28.5,67.32 C1.1 | 18.5,35.58 26.83,35.58 29.83,32.58 | 18.5,35.58 F1.2 8.75,36.5 13.26,41.01 13.26,53 | 18.5,35.58 18.5,5.5 20.27,3.73 JP11.2 25.58,2.15 R16.1 28.57,2.15 Q1.4
  Bottom 0.2: v35.92,63.4 33.1,63.4 32.5,64 | v31.97,66.54 31.97,64.53 32.5,64 | v13.14,63.33 10.17,63.33 9,64.5 v9,66.43 | JP2.3 28.23,59.73 32.5,64
  pour Top (no thermals): 3.43,73.64 3.43,66.97 3.84,66.56 12.16,66.56 12.23,66.62 12.23,68.22 11.78,68.67 9.46,68.67 8.42,69.71 8.42,76.03 7.96,76.49 4.58,76.49 3.42,75.33
  pour Top (no thermals): 26.21,73.74 26.21,67.07 26.63,66.66 34.95,66.66 35.01,66.72 35.01,68.32 34.56,68.77 32.24,68.77 31.2,69.81 31.2,76.14 30.74,76.59 27.36,76.59 26.2,75.43
  pour Top (no thermals): 26.45,35.12 26.45,28.46 26.86,28.04 35.18,28.04 35.25,28.1 35.25,29.71 34.8,30.15 32.48,30.15 31.44,31.19 31.44,37.52 30.98,37.98 27.59,37.98 26.44,36.82
VCC1_EN  (via drill 0.35)
  Top 0.2: v14.5,52 14.5,39.5 v17,37 | v19.5,34.5 19.5,17.5 25.5,11.5 v39.75,11.5 v39.76,11.51
  Bottom 0.2: JP6.1 13.71,52 v14.5,52 | v17,37 v19.5,34.5 | v39.76,11.51 39.76,4.28
VCC_1  (via drill 0.4)
  Top 0.2: U3.1 14.13,67.49 14.27,67.62 16.92,67.62 C14.1 C13.1 | R7.2 18.78,60.68 R9.2 | TP6.P$1 49.25,55.09 49.5,55.34
  Top 0.3: U4.1 43.42,48.12 43.02,48.52
  Top 0.5: U4.1 46.29,47.31 JP7.1 | R7.2 18.96,62 v21,62
  Top 1: C13.1 v21,67.23 22.27,67.23 24.5,65 24.5,51 27.08,48.42 JP8.3 38.19,48.53 43.01,48.53 43.02,48.52 43.43,48.93 C16.1 43.63,50.63 48.34,55.34 49.5,55.34
  Bottom 0.5: v21,62 v21,67.23
VCC_2
  Top 0.2: TP5.P$1 49.25,41.44 49,41.69
  Top 0.5: JP7.2 46.29,44.71 U4.5 C17.1
  Top 1: 49,41.69 43.45,41.69 C17.1
VIN  (1 unrouted)
  Top 0.2: U5.13 2.13,26.14 C18.1 | TP1.P$1 10.45,46.54
  Top 1: C18.1 3.02,27.25 3.02,36.52 5.21,38.71 5.21,41.35 5.15,41.41 5.15,43.65 5.67,44.17
  pour Top (no thermals): 1.85,26.89 5.89,26.89 6.2,26.59 6.2,26.07 6.12,25.99 3.24,25.99 2.88,25.63 1.32,25.63 1.23,25.71 1.23,26.77 1.35,26.89 1.84,26.89

### Text on the board
tNames: GND | 3.3V | GND | VIN | EN | EXT_EN | VIN | EN | EXT_EN | VIN | SYNC | GND | VIN | SYNC | GND | VCC_1 | GND | VCC1 | V_IN | VCC2 | GND | VCC_2 | GND | !PGOOD | 5V | !CHG | GND | VIN | EN | EXT_EN | VIN | SYNC | GND | V_BATT | V_GSM | GND | GSM_EN | GDP 2022 - GlacTracker / Layout: Marcus Corbin / Supervisor: Kirk Martinez | 3.3V_EN | VCC1_EN | 5V_EN | V_SYS